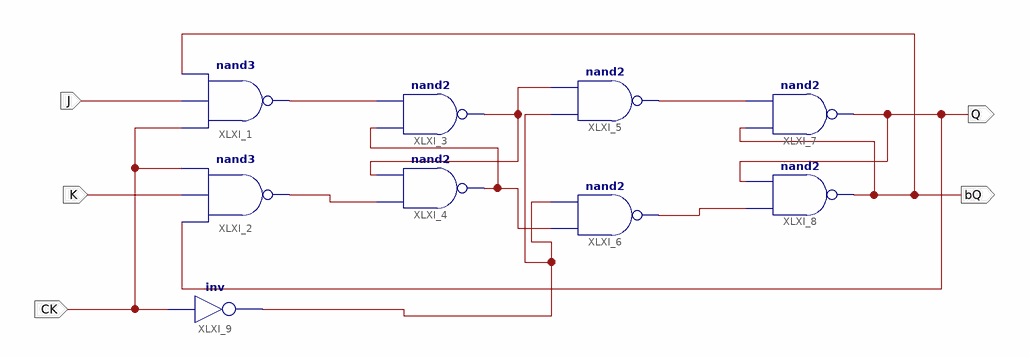
[diagram p0: schematic sheet 1]
// Xilinx ISE schematic JK_FF_NE.sch (spartan6) as structural Verilog: 9 symbols, 5 ports
module JK_FF_NE (
  input  J,
  input  K,
  input  CK,
  output bQ,
  output Q
);

  wire XLXN_1, XLXN_2, XLXN_3, XLXN_4, XLXN_5, XLXN_6, XLXN_17;

  nand XLXI_1 (XLXN_1, CK, J, bQ);
  nand XLXI_2 (XLXN_4, Q, K, CK);
  nand XLXI_3 (XLXN_2, XLXN_5, XLXN_1);
  nand XLXI_4 (XLXN_5, XLXN_4, XLXN_2);
  nand XLXI_5 (XLXN_3, XLXN_17, XLXN_2);
  nand XLXI_6 (XLXN_6, XLXN_5, XLXN_17);
  nand XLXI_7 (Q, bQ, XLXN_3);
  nand XLXI_8 (bQ, XLXN_6, Q);
  not XLXI_9 (XLXN_17, CK);
endmodule
